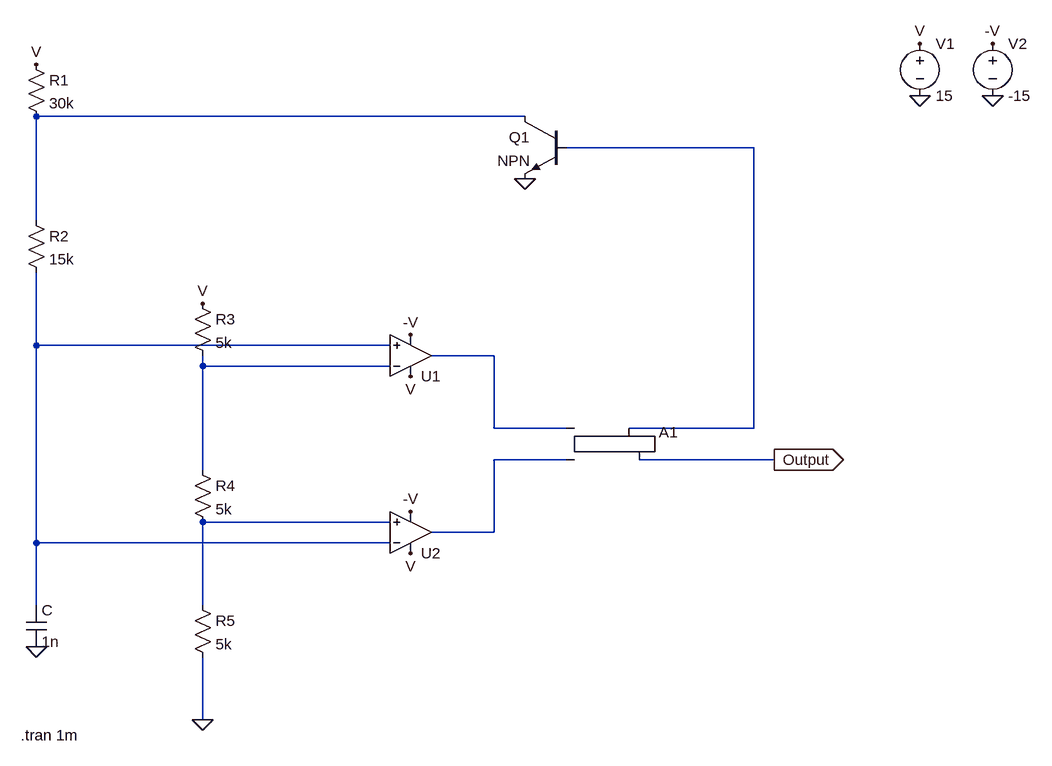
[diagram p0: schematic 1b.asc]
1b.asc, the LTspice schematic file:
Version 4.1
SHEET 1 1260 680
WIRE 464 -288 -288 -288
WIRE 816 -240 528 -240
WIRE -288 -128 -288 -288
WIRE -288 64 -288 -48
WIRE 256 64 -288 64
WIRE 416 80 320 80
WIRE -32 96 -32 80
WIRE 256 96 -32 96
WIRE 416 192 416 80
WIRE 528 192 416 192
WIRE 816 192 816 -240
WIRE 816 192 624 192
WIRE 528 240 416 240
WIRE 848 240 640 240
WIRE -32 256 -32 96
WIRE 256 336 -32 336
WIRE 416 352 416 240
WIRE 416 352 320 352
WIRE -288 368 -288 64
WIRE 256 368 -288 368
WIRE -288 464 -288 368
WIRE -32 464 -32 336
WIRE -32 640 -32 544
FLAG -32 640 0
FLAG -32 0 V
FLAG 288 112 V
FLAG 288 384 V
FLAG -288 528 0
FLAG 464 -192 0
FLAG -288 -368 V
FLAG 848 240 Output
IOPIN 848 240 Out
FLAG 288 320 -V
FLAG 288 48 -V
FLAG 1072 -320 0
FLAG 1184 -320 0
FLAG 1072 -400 V
FLAG 1184 -400 -V
SYMBOL OpAmps\\UniversalOpAmp2 288 80 M180
SYMATTR InstName U1
SYMBOL OpAmps\\UniversalOpAmp2 288 352 M180
SYMATTR InstName U2
SYMBOL res -48 -16 R0
SYMATTR InstName R3
SYMATTR Value 5k
SYMBOL res -48 240 R0
SYMATTR InstName R4
SYMATTR Value 5k
SYMBOL res -48 448 R0
SYMATTR InstName R5
SYMATTR Value 5k
SYMBOL cap -304 464 R0
SYMATTR InstName C
SYMATTR Value 1n
SYMBOL Digital\\srflop 576 144 R0
SYMATTR InstName A1
SYMBOL npn 528 -288 M0
SYMATTR InstName Q1
SYMBOL res -304 -144 R0
SYMATTR InstName R2
SYMATTR Value 15k
SYMBOL res -304 -384 R0
SYMATTR InstName R1
SYMATTR Value 30k
SYMBOL voltage 1072 -416 R0
SYMATTR InstName V1
SYMATTR Value 15
SYMBOL voltage 1184 -416 R0
SYMATTR InstName V2
SYMATTR Value -15
TEXT -312 664 Left 2 !.tran 1m

The netlist it stands for:
* 1b.asc
X§U1 N003 N005 V -V N004 level2 Avol=1Meg GBW=10Meg Slew=10Meg Ilimit=25m Rail=0 Vos=0 En=0 Enk=0 In=0 Ink=0 Rin=500Meg  ; pins In+ In- V+ V- OUT
X§U2 N007 N003 V -V N006 level2 Avol=1Meg GBW=10Meg Slew=10Meg Ilimit=25m Rail=0 Vos=0 En=0 Enk=0 In=0 Ink=0 Rin=500Meg  ; pins In+ In- V+ V- OUT
R3 V N005 5k
R4 N005 N007 5k
R5 N007 0 5k
C N003 0 1n
A1 N004 N006 0 0 0 Output N002 0 SRFLOP
Q1 N001 N002 0 0 NPN
R2 N001 N003 15k
R1 V N001 30k
V1 V 0 15
V2 -V 0 -15
.model NPN NPN
.model PNP PNP
.lib standard.bjt
.tran 1m
.lib UniversalOpAmp2.lib
.backanno
.end